# EAGLE design driver (EAGLE 7.7.0)
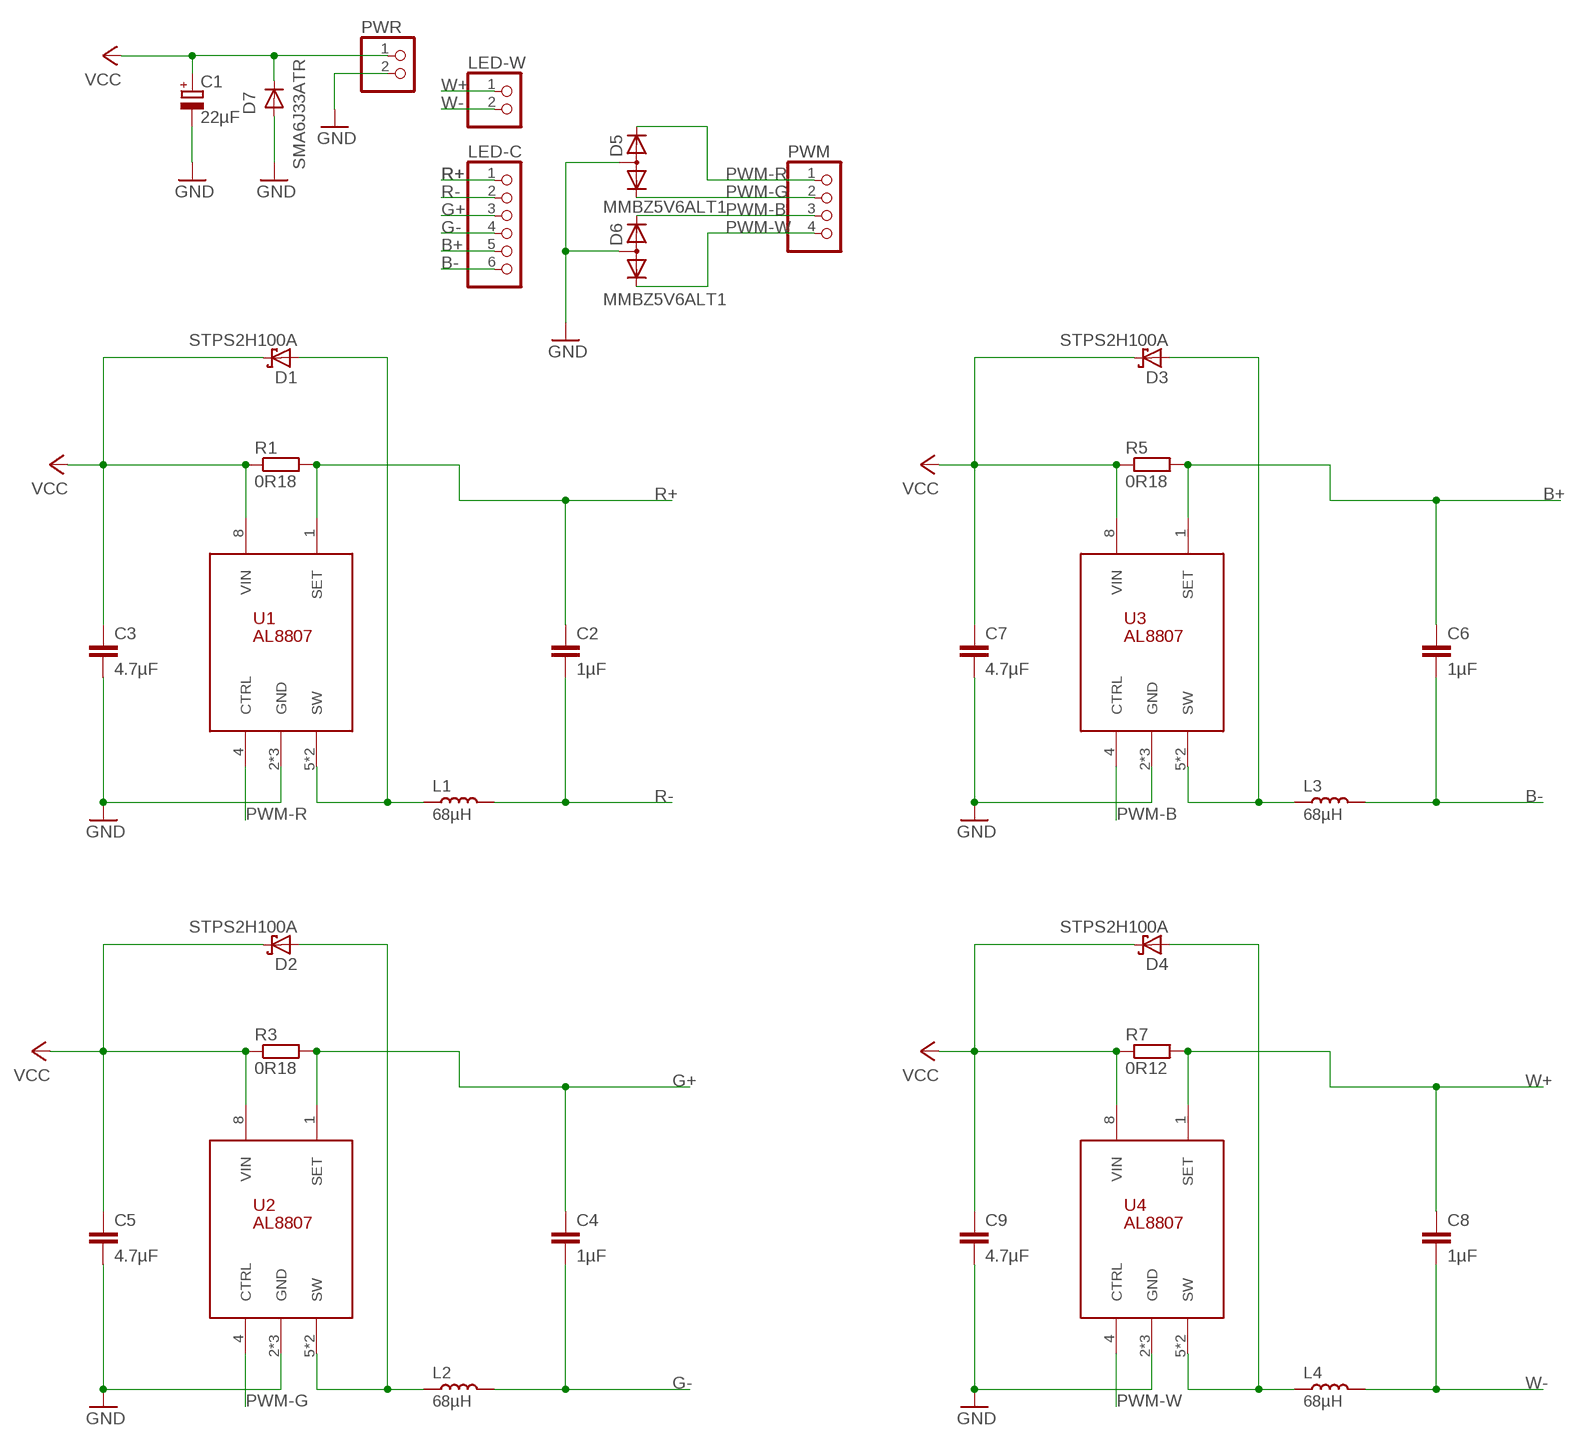
[diagram p0: schematic, sheet 1]

## Parts
C1  22µF  CPOL-EUE2-5  [E2-5]
C2  1µF  C-EUC1206  [C1206]
C3  4.7µF  C-EUC1206  [C1206]
C4  1µF  C-EUC1206  [C1206]
C5  4.7µF  C-EUC1206  [C1206]
C6  1µF  C-EUC1206  [C1206]
C7  4.7µF  C-EUC1206  [C1206]
C8  1µF  C-EUC1206  [C1206]
C9  4.7µF  C-EUC1206  [C1206]
D1  STPS2H100A  [ST-DO-214AC]
D2  STPS2H100A  [ST-DO-214AC]
D3  STPS2H100A  [ST-DO-214AC]
D4  STPS2H100A  [ST-DO-214AC]
D5  MMBZ5V6ALT1  DIODE-2CA|ACSOT23  [SOT23]
D6  MMBZ5V6ALT1  DIODE-2CA|ACSOT23  [SOT23]
D7  SMA6J33ATR  DIODE-DO-214AC  [DO-214AC]
L1  68µH  INDUCTOR-SRR1260  [SRR1260]
L2  68µH  INDUCTOR-SRR1260  [SRR1260]
L3  68µH  INDUCTOR-SRR1260  [SRR1260]
L4  68µH  INDUCTOR-SRR1260  [SRR1260]
LED-C  PINHD-1X6  [1X06]
LED-W  PINHD-1X2  [1X02]
PWM  PINHD-1X4  [1X04]
PWR  PINHD-1X2  [1X02]
R1  0R18  R-EU_R0805  [R0805]
R3  0R18  R-EU_R0805  [R0805]
R5  0R18  R-EU_R0805  [R0805]
R7  0R12  R-EU_R0805  [R0805]
U1  AL8807  [MSOP-8EP]
U2  AL8807  [MSOP-8EP]
U3  AL8807  [MSOP-8EP]
U4  AL8807  [MSOP-8EP]

## Nets
B+: C6.1 LED-C.5 R5.2 U3.1(SET)
B-: C6.2 L3.2 LED-C.6
G+: C4.1 LED-C.3 R3.2 U2.1(SET)
G-: C4.2 L2.2 LED-C.4
GND: C1.- C3.2 C5.2 C7.2 C9.2 D5.3(A) D6.3(A) D7.A PWR.2 U1.2(GND) U1.3(GND) U1.9(GND) U2.2(GND) U2.3(GND) U2.9(GND) U3.2(GND) U3.3(GND) U3.9(GND) U4.2(GND) U4.3(GND) U4.9(GND)
N$3: D1.A L1.1 U1.5(SW) U1.6(SW)
N$7: D2.A L2.1 U2.5(SW) U2.6(SW)
N$12: D3.A L3.1 U3.5(SW) U3.6(SW)
N$17: D4.A L4.1 U4.5(SW) U4.6(SW)
PWM-B: D6.2(K2) PWM.3 U3.4(CTRL)
PWM-G: D5.1(K1) PWM.2 U2.4(CTRL)
PWM-R: D5.2(K2) PWM.1 U1.4(CTRL)
PWM-W: D6.1(K1) PWM.4 U4.4(CTRL)
R+: C2.1 LED-C.1 R1.2 U1.1(SET)
R-: C2.2 L1.2 LED-C.2
VCC: C1.+ C3.1 C5.1 C7.1 C9.1 D1.C D2.C D3.C D4.C D7.C PWR.1 R1.1 R3.1 R5.1 R7.1 U1.8(VIN) U2.8(VIN) U3.8(VIN) U4.8(VIN)
W+: C8.1 LED-W.1 R7.2 U4.1(SET)
W-: C8.2 L4.2 LED-W.2

## Library data of the parts
C1 = resistor:CPOL-EU: POLARIZED CAPACITOR, European symbol
C2-C9 = resistor:C-EU: CAPACITOR, European symbol
D1-D4 = semiconductors:STPS2H100A: Periodische Sperrspannung Vrrm, max.: 100V Durchlassstrom (mittlerer) If(AV): 2A Bauform: DO-214AC Anzahl der Pins: 2Pin(s) Durchlassspannung Vf max.: 650mV Spitzendurchlassstrom Ifsm, max.: 75A Betriebstemperatur, max.: 175°C Produktpalette: STPS2 Series; FARNELL_PART_NUMBER: 1467551
D5 D6 = diode:DIODE-2CA|AC: Dual DIODE Cathode-Anode|Anode-Cathode
D7 = diode:DIODE-: DIODE
L1-L4 = passive:INDUCTOR-SRR1260
LED-C = pinhead:PINHD-1X6: PIN HEADER
LED-W PWR = pinhead:PINHD-1X2: PIN HEADER
PWM = pinhead:PINHD-1X4: PIN HEADER
R1 R3 R5 R7 = resistor:R-EU_: RESISTOR, European symbol
U1-U4 = ics:AL8807

## Board
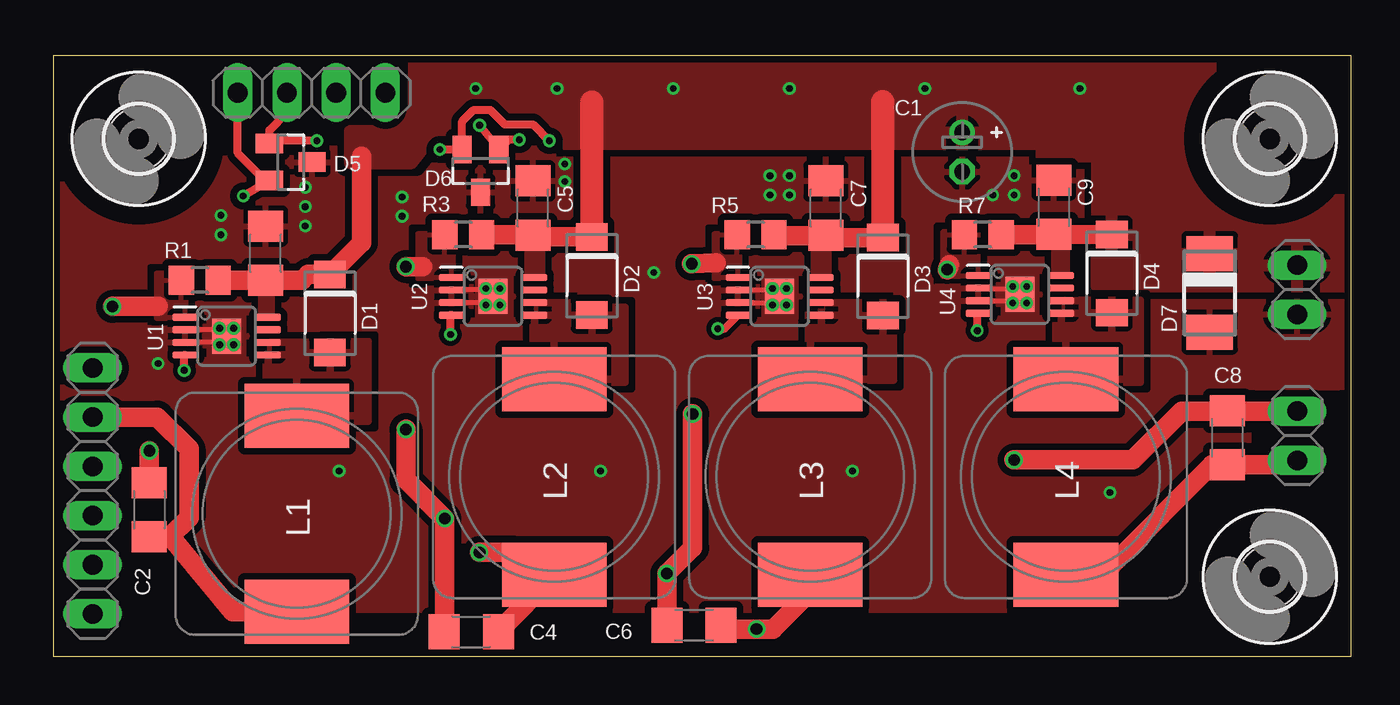
[diagram p1: board, top side]
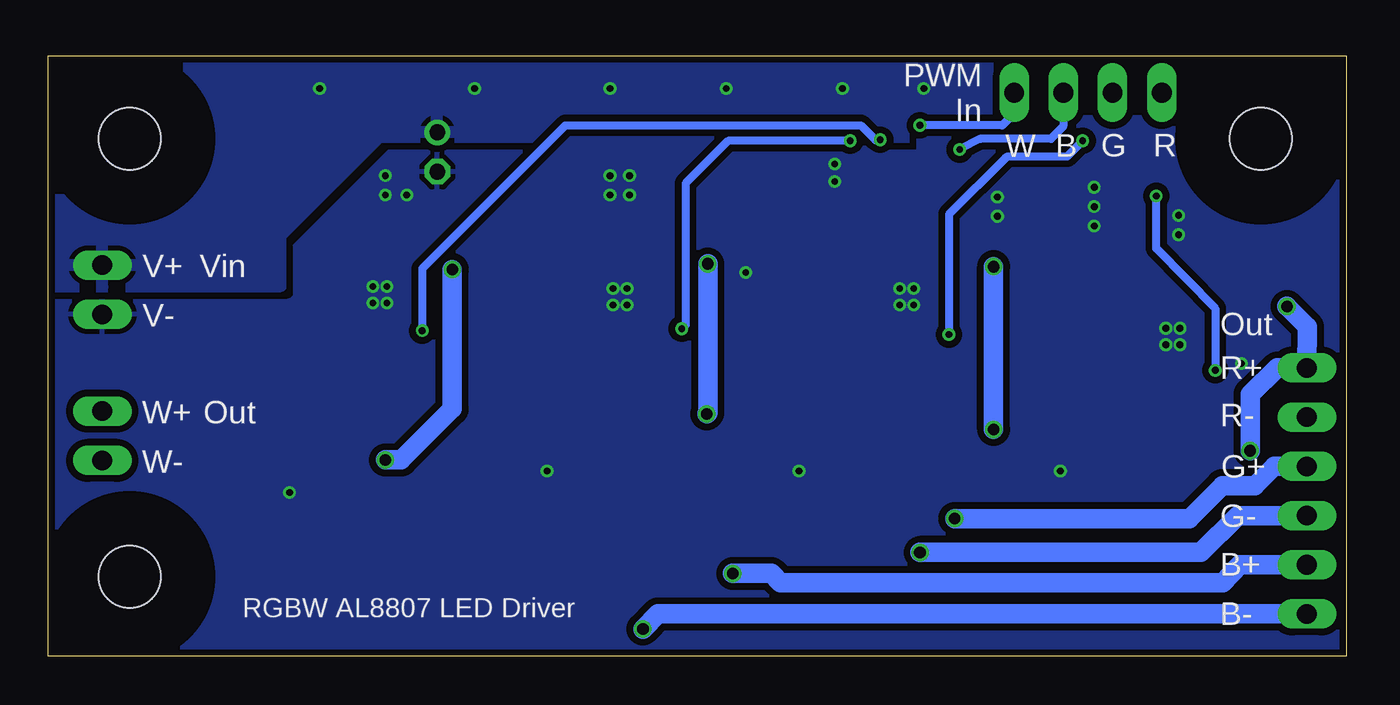
[diagram p2: board, bottom side, seen from below]

Size 67 x 31 mm. Coordinates in mm from the lower left corner, seen from the top.
Outline: 0,0 67,0 67,31 0,31 0,0
Copper layers (1*16): Top 0.035mm / dielectric 1.5mm / Bottom 0.035mm
Design rules "SeeedStudio_2layer_DRU_no_angle_20140221 *": minimum track width 6mil, minimum drill 12mil, track to track 8mil, track to pad 8mil, pad to pad 8mil, via to via 8mil, smd to smd 0mil, copper to edge 10mil, drill to drill 10mil, minimum pad ring 10mil, minimum via ring 6mil, stop-mask expansion 2mil, vias tented up to drill 100mil, thermal gap 10mil

### Footprints (pad centres in the part's own frame; a part is rotated, then mirrored left to right if it is on the bottom)
E2-5 = drill 0.813 pad 1.27: + -1.016,0 | drill 0.813 pad 1.27 octagon: - 1.016,0
C1206 = smd 1.6 x 1.8: 1 -1.4,0; 2 1.4,0
ST-DO-214AC = smd 1.4 x 1.64: A 2.03,0; C -2,0
SOT23 = smd 1 x 1.4: 1 -0.95,-1.1; 2 0.95,-1.1; 3 0,1.1
DO-214AC = smd 1.8 x 2.4: A 2.025,0; C -2.025,0
SRR1260 = smd 3.3 x 5.4: 1 -5.05,0; 2 5.05,0
1X06 = drill 1.016 long: 1 -6.35,0; 2 -3.81,0; 3 -1.27,0; 4 1.27,0; 5 3.81,0; 6 6.35,0
1X02 = drill 1.016 long: 1 -1.27,0; 2 1.27,0
1X04 = drill 1.016 long: 1 -3.81,0; 2 -1.27,0; 3 1.27,0; 4 3.81,0
R0805 = smd 1.3 x 1.5: 1 -0.95,0; 2 0.95,0
MSOP-8EP = smd 1.3 x 0.38: 1 -2.15,0.975; 2 -2.15,0.325; 3 -2.15,-0.325; 4 -2.15,-0.975; 5 2.15,-0.975; 6 2.15,-0.325; 7 2.15,0.325; 8 2.15,0.975 | smd 1.5 x 1.8: 9 0,0
3,2 = hole 3.2: 0,0

### Placement (x,y rotation side)
C1  46.92,26.02 270 top
C2  4.95,7.55 270 top
C3  10.96,20.8 90 top
C4  21.57,1.25 0 top
C5  24.75,23.13 90 top
C6  33.08,1.6 0 top
C7  39.88,23.13 90 top
C8  60.6,11.27 270 top
C9  51.66,23.16 90 top
D1  14.28,17.7 270 top
D2  27.8,19.64 270 top
D3  42.83,19.61 270 top
D4  54.65,19.76 270 top
D5  12.25,25.5 270 top
D6  22.05,25.05 180 top
D7  59.7,18.75 270 top
L1  12.56,7.35 270 top
L2  25.85,9.25 270 top
L3  39.08,9.25 270 top
L4  52.27,9.25 270 top
LED-C  2.02,8.53 270 top
LED-W  64.22,11.38 270 top
PWM  13.32,29.08 0 top
PWR  64.22,18.91 270 top
R1  7.55,19.41 180 top
R3  21.16,21.75 180 top
R5  36.26,21.75 180 top
R7  47.98,21.75 180 top
U1  8.94,16.52 0 top
U2  22.7,18.57 0 top
U3  37.49,18.57 0 top
U4  49.9,18.67 0 top
U$1  [3,2]  62.8,4.1 0 top
U$2  [3,2]  62.8,26.7 0 top
U$3  [3,2]  4.4,26.7 0 top

### Tracks (layer width: path | path; a pad name or v marks a point on that pad's centre or on a via)
B+  (via drill 0.6)
  Top 1: v32.95,20.25 34.2,20.3 | v33,12.5 33,5.59 v31.68,4.27 C6.1
  Bottom 1: LED-C.5 5.49,4.71 6.35,3.8 29.2,3.8 29.67,4.27 v31.68,4.27 | v33,12.5 32.95,12.55 v32.95,20.25
  pour Top (isolate 0.3, rank 2): 34.1,21.8 34.1,19.5 35.45,19.5 35.45,21.8
B-  (via drill 0.6)
  Top 1: C6.2 34.67,1.4 v36.3,1.4 37.16,1.4 39.27,3.52 L3.2
  Bottom 1: v36.3,1.4 35.52,2.17 LED-C.6
G+  (via drill 0.6)
  Top 1: C4.1 arc90 20.2,1.28 v20.2,7.1 18.2,9.1 v18.2,11.7 | v18.2,20.1 19.05,20.1
  Bottom 1: LED-C.3 3.71,9.79 4.7,8.8 6.4,8.8 8.1,7.1 v20.2,7.1 | v18.2,11.7 v18.2,20.1
  pour Top (isolate 0.3, rank 2): 18.8,21.8 18.8,19.5 20.65,19.5 20.65,21.8
G-  (via drill 0.6)
  Top 1: L2.2 24.1,5.1 23.85,5.35 v22,5.35 | 26.12,3.78 L2.2 | C4.2 L2.2
  Bottom 1: LED-C.4 5.59,7.25 7.5,5.35 v22,5.35
GND  (via drill 0.35)
  Top 0.254: 35.4,18.9 37.2,18.9 | 37.2,18.25 36.1,18.25 U3.3 | 47.75,18.95 49.55,18.95 | U4.3 49.55,18.35 | 8.6,16.2 U1.3 | 8.6,16.85 U1.2 | 22.35,18.9 U2.2 | 22.35,18.25 U2.3
  Top 0.37: 8.32,16.2 8.47,16.05 | 36.88,18.25 37.02,18.1 | 49.27,18.35 49.42,18.2
  other vias: 9.3,16.93 9.3,16.07 8.57,16.07 8.57,16.93 23.05,18.98 23.05,18.12 22.32,18.12 22.32,18.98 37.85,18.98 37.85,18.12 37.12,18.12 37.12,18.98 50.25,19.07 50.25,18.23 49.52,18.23 49.52,19.07 18,22.7 31,19.8 5.4,15.1 26.4,24.5 26.4,25.4 13,23.2 8.65,21.75 13,24.2 8.65,22.75 38,23.8 38,24.8 37,24.8 37,23.8 49.6,24.8 49.6,23.8 48.5,23.8 54.55,8.45 41.25,9.55 28.25,9.55 14.75,9.55 13,22.2 18,23.7
  pour Top (isolate 0.254, rank 2, no thermals): 8.15,17.57 8.15,15.4 9.72,15.4 9.72,17.57
  pour Top (isolate 0.254, no thermals): 22,19.62 22,17.45 23.52,17.45 23.52,19.62
  pour Top (isolate 0.254, no thermals): 36.75,19.62 36.75,17.45 38.27,17.45 38.27,19.62
  pour Top (isolate 0.254, no thermals): 49.15,19.73 49.15,17.55 50.67,17.55 50.67,19.73
  pour Bottom (isolate 0.35, rank 6): 0,27.8 67,27.8 67,0 0,0
  pour Top (isolate 0.35, rank 5): 0,2.4 67,2.4 67,19 53.38,19 53.38,25.8 51,25.8 51,26.2 0,26.2
  pour Top (isolate 0.254, rank 3): 45.65,19.73 45.65,16.05 48.52,16 48.52,19.68
  pour Top (isolate 0.254, rank 3): 32.8,19.18 32.8,15.5 35.67,15.45 35.67,19.12
  pour Top (isolate 0.254, rank 3): 19.35,19.02 19.35,15.35 21.23,15.3 21.23,18.98
  pour Top (isolate 0.254, rank 3): 4.8,16.93 4.85,13.8 7.58,13.8 7.53,16.93
N$2
  pour Top: 20.45,19 21.3,19 21.3,17.55 20.45,17.55
  pour Top: 36.1,18.95 35.45,18.95 35.45,18.2 36.1,18.2
  pour Top: 47.95,19.05 48.45,19.05 48.45,18.3 47.95,18.3
  pour Top: 6.7,16.9 7.5,16.9 7.5,15.55 6.7,15.55
  cutout Top: 62,13.6 66.45,13.6 66.45,9.1 62,9.1
N$3
  pour Top (isolate 0.254, rank 2): 11.22,16.2 11.22,15.57 10.97,15.57 10.97,12.12 16.25,12.12 16.25,16.25
N$7
  pour Top (isolate 0.254, rank 2): 25,18.25 25,17.5 24.75,17.5 24.75,14.12 29.5,14.12 29.5,18 26.75,18 26.75,18.25
N$12
  pour Top (isolate 0.254, rank 2): 38.98,17.75 38.98,13 41.75,13 41.75,14.25 43.38,14.25 43.38,18.25 40,18.25 40,17.75
N$17
  pour Top (isolate 0.305, rank 2, no thermals): 52.05,12.9 54.7,12.9 54.7,14.9
  pour Top (isolate 0.254, rank 2): 52.25,18.38 52.25,17.62 51.75,17.62 51.75,14.12 56.12,14.12 56.12,18.38
PWM-B  (via drill 0.35)
  Top 0.38: 34.65,16.9 U3.4
  Top 0.406: v34.3,16.9 34.65,16.9 | v19.95,26.15 D6.2 21.1,27.6 21.7,28.2 22.55,28.2 23.3,27.45 24.75,27.45 v25.6,26.6
  Bottom 0.406: PWM.3 14.6,27.34 15.24,26.7 18.9,26.7 v19.95,26.15 | v34.3,16.9 34.1,17.1 34.1,24.4 31.9,26.6 v25.6,26.6
PWM-G  (via drill 0.35)
  Top 0.406: v20.5,16.6 20.5,17.59 U2.4 | PWM.2 12.05,28.77 12.05,28.05 11.15,27.15 D5.1 11.3,26.6 v13.6,26.6
  Bottom 0.406: v20.5,16.6 20.5,22.8 17.59,25.71 arc45 17.37,25.8 14.4,25.8 v13.6,26.6
PWM-R  (via drill 0.35)
  Top 0.406: v6.75,14.75 6.75,15.54 U1.4 | v9.8,23.75 D5.2 10.63,24.85 9.52,25.96 PWM.1
  Bottom 0.406: v6.75,14.75 6.75,17.95 9.8,21.05 v9.8,23.75
PWM-W  (via drill 0.35)
  Top 0.406: v47.7,16.8 47.7,17.7 U4.4 | v22,27.4 D6.1 23.5,26.65 v24.05,26.65
  Bottom 0.406: PWM.4 17.14,28.02 17.75,27.4 v22,27.4 | v47.7,16.8 47.7,20 40.3,27.4 25.05,27.4 24.3,26.65 v24.05,26.65
R+  (via drill 0.6)
  Top 1: v4.95,10.6 C2.1 | 5.4,18.05 v3.05,18.05
  Bottom 1: v4.95,10.6 4.95,13.52 3.54,14.88 LED-C.1 2,17 v3.05,18.05
  pour Top (isolate 0.3, rank 2): 5.3,19.75 5.3,17.45 6.85,17.45 6.85,19.75
R-
  Top 1: LED-C.2 5.36,12.34 7,10.7 7,7.15 6.03,6.17 | C2.2 6.03,6.17 | 6.03,6.17 9.25,2.3 L1.2
VCC  (via drill 0.35)
  Top 1: R1.1 C3.1 12.85,19.4 13.15,19.7 D1.C 15.9,21.32 15.9,25.8 | D4.C C9.1 50.85,21.75 49.55,21.75 R7.1 | D3.C 42.1,21.6 40.75,21.6 C7.1 39.1,21.7 37.8,21.7 R5.1 | D2.C 27.3,21.65 25.25,21.65 C5.1 23.95,21.75 22.65,21.75 R3.1
  Top 1.2: D3.C 42.83,28.62 | D2.C 27.8,28.6
  other vias: 21.8,29.3 26,29.3 32,29.3 38,29.3 45,29.3 53,29.3
  pour Top (isolate 0.3, rank 2, no thermals): 10.7,19.55 11.3,19.55 11.3,17.5 10.7,17.5
  pour Top (isolate 0.3, rank 2, no thermals): 24.45,21.55 25.25,21.55 25.25,19.5 24.45,19.5
  pour Top (isolate 0.3, rank 2, no thermals): 39.25,21.85 40.05,21.85 40.05,19.5 39.25,19.5
  pour Top (isolate 0.3, rank 2, no thermals): 51.65,21.65 52.35,21.65 52.35,19.6 51.65,19.6
  pour Bottom (isolate 0.35, rank 5): 0,31 67,31 67,19.1 55,19.1 55,21.71 49.91,26.8 0,26.8
  pour Top (isolate 0.35, rank 4): 67.1,19.1 67,31 arc0 18.6,31 18.6,28.23 17.47,27.1 15.3,27.1 15.3,25.45 18.5,25.45 19.29,26.45 51,26.45 51,25.8 53.88,25.8 53.85,19.1
W+  (via drill 0.6)
  Top 1: v46.15,19.95 46.25,20.2 | v49.6,10.13 55.73,10.13 58.25,12.65 60.58,12.65 C8.1 60.62,12.64 LED-W.1
  Bottom 1: v49.6,10.13 48.78,10.13 46.15,12.76 v46.15,19.95
  pour Top (isolate 0.3, rank 2): 45.9,21.9 45.9,19.6 47.75,19.6 47.75,21.9
W-
  Top 1: L4.2 54.65,4.7 59.82,9.87 C8.2 64.03,9.87 LED-W.2

### Text on the board
bPlace: PWM / In | Vin | Out | R+ | R- | Out | G+ | G- | B+ | B-
bNames: R | G | B | W | V+ | V- | W+ | W- | RGBW AL8807 LED Driver